# Altium project besc proj.PrjPcb
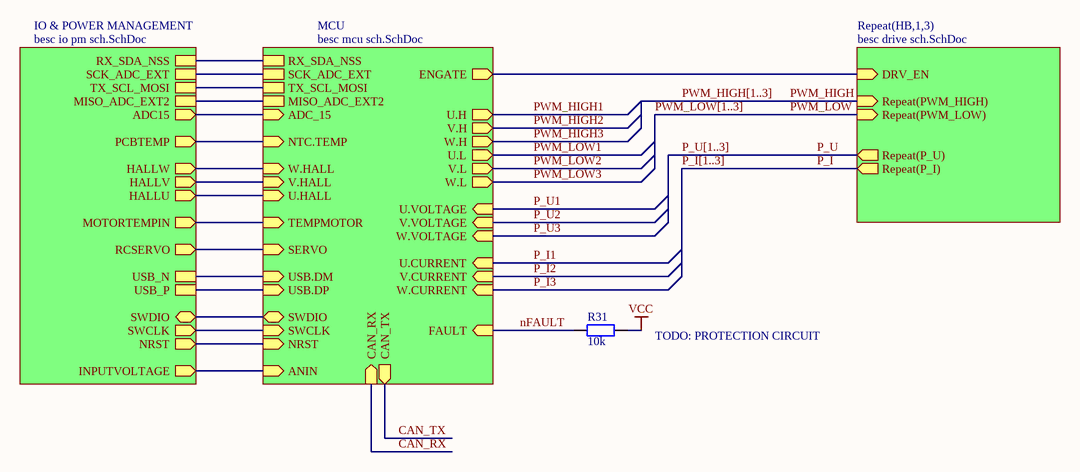
[diagram p0: besc sch.SchDoc]
4 sheets, 170 parts. Net scope: hierarchical (ports join the sheet entries above them; power ports are global).
Board file: besc pcb.PcbDoc
Sheets:
  besc sch.SchDoc
    MCU = besc mcu sch.SchDoc
    IO & POWER MANAGEMENT = besc io pm sch.SchDoc
    HB1 = besc drive sch.SchDoc
    HB2 = besc drive sch.SchDoc
    HB3 = besc drive sch.SchDoc

## Sheet besc sch.SchDoc
size A4

### Parts
R31  10k  [0603]

### Sub-sheets
IO & POWER MANAGEMENT = besc io pm sch.SchDoc: USB_P, USB_N, PCBTEMP (out), HALLW (out), HALLV (out), HALLU (out), RCSERVO (out), NRST (out), SWCLK (out), SWDIO (bidir), RX_SDA_NSS, SCK_ADC_EXT, TX_SCL_MOSI, MISO_ADC_EXT2, MOTORTEMPIN (out), INPUTVOLTAGE (out), ADC15 (out)
MCU = besc mcu sch.SchDoc: W.VOLTAGE (in), V.VOLTAGE (in), U.VOLTAGE (in), W.H (out), V.H (out), U.H (out), W.L (out), V.L (out), U.L (out), V.CURRENT (in), U.CURRENT (in), ENGATE (out), FAULT (in), NTC.TEMP (in), SCK_ADC_EXT, MISO_ADC_EXT2, W.HALL (in), V.HALL (in), U.HALL (in), USB.DM (in), USB.DP (in), SWCLK (in), SWDIO (bidir), SERVO (in), CAN_RX (in), CAN_TX (out), TEMPMOTOR (in), ANIN (in), NRST (in), W.CURRENT (in), RX_SDA_NSS, TX_SCL_MOSI, ADC_15 (in)
Repeat(HB,1,3) = besc drive sch.SchDoc: Repeat(P_U) (out), Repeat(PWM_HIGH) (in), Repeat(PWM_LOW) (in), Repeat(P_I) (out), DRV_EN (in)

### Nets
VCC: R31.2
ADC1: sheet MCU/MISO_ADC_EXT2, sheet IO & POWER MANAGEMENT/MISO_ADC_EXT2
ADC15: sheet MCU/ADC_15, sheet IO & POWER MANAGEMENT/ADC15
ENGATE: sheet MCU/ENGATE, sheet Repeat(HB,1,3)/DRV_EN
HALLU: sheet MCU/U.HALL, sheet IO & POWER MANAGEMENT/HALLU
HALLV: sheet MCU/V.HALL, sheet IO & POWER MANAGEMENT/HALLV
HALLW: sheet MCU/W.HALL, sheet IO & POWER MANAGEMENT/HALLW
INPUTVOLTAGE: sheet MCU/ANIN, sheet IO & POWER MANAGEMENT/INPUTVOLTAGE
MOTORTEMPIN: sheet MCU/TEMPMOTOR, sheet IO & POWER MANAGEMENT/MOTORTEMPIN
nFAULT: R31.1 ; sheet MCU/FAULT
NRST: sheet MCU/NRST, sheet IO & POWER MANAGEMENT/NRST
P_I: sheet Repeat(HB,1,3)/Repeat(P_I)
P_U: sheet Repeat(HB,1,3)/Repeat(P_U)
PCBTEMP: sheet MCU/NTC.TEMP, sheet IO & POWER MANAGEMENT/PCBTEMP
PWM_HIGH: sheet Repeat(HB,1,3)/Repeat(PWM_HIGH)
PWM_LOW: sheet Repeat(HB,1,3)/Repeat(PWM_LOW)
RCSERVO: sheet MCU/SERVO, sheet IO & POWER MANAGEMENT/RCSERVO
RX: sheet MCU/RX_SDA_NSS, sheet IO & POWER MANAGEMENT/RX_SDA_NSS
SCK: sheet MCU/SCK_ADC_EXT, sheet IO & POWER MANAGEMENT/SCK_ADC_EXT
SWDIO: sheet MCU/SWDIO, sheet IO & POWER MANAGEMENT/SWDIO
SWSCK: sheet MCU/SWCLK, sheet IO & POWER MANAGEMENT/SWCLK
TX: sheet MCU/TX_SCL_MOSI, sheet IO & POWER MANAGEMENT/TX_SCL_MOSI
USB_N: sheet MCU/USB.DM, sheet IO & POWER MANAGEMENT/USB_N
USB_P: sheet MCU/USB.DP, sheet IO & POWER MANAGEMENT/USB_P

### Buses and harness runs
bus P_I[1..3]
bus P_U[1..3]
bus PWM_HIGH[1..3]
bus PWM_LOW[1..3]

### Notes on the sheet
- (near R31) TODO: PROTECTION CIRCUIT

### Library data of the parts
R31 = Res2: Resistor; Published: 8-Jun-2000; LatestRevisionDate: 17-Jul-2002; LatestRevisionNote: Re-released for DXP Platform.; PackageReference: AXIAL-0.4; Publisher: Altium Limited; PackageDescription: Axial Device, Thru-Hole; 2 Leads; 0.4 in Pin Spacing

## Sheet besc mcu sch.SchDoc
size A4
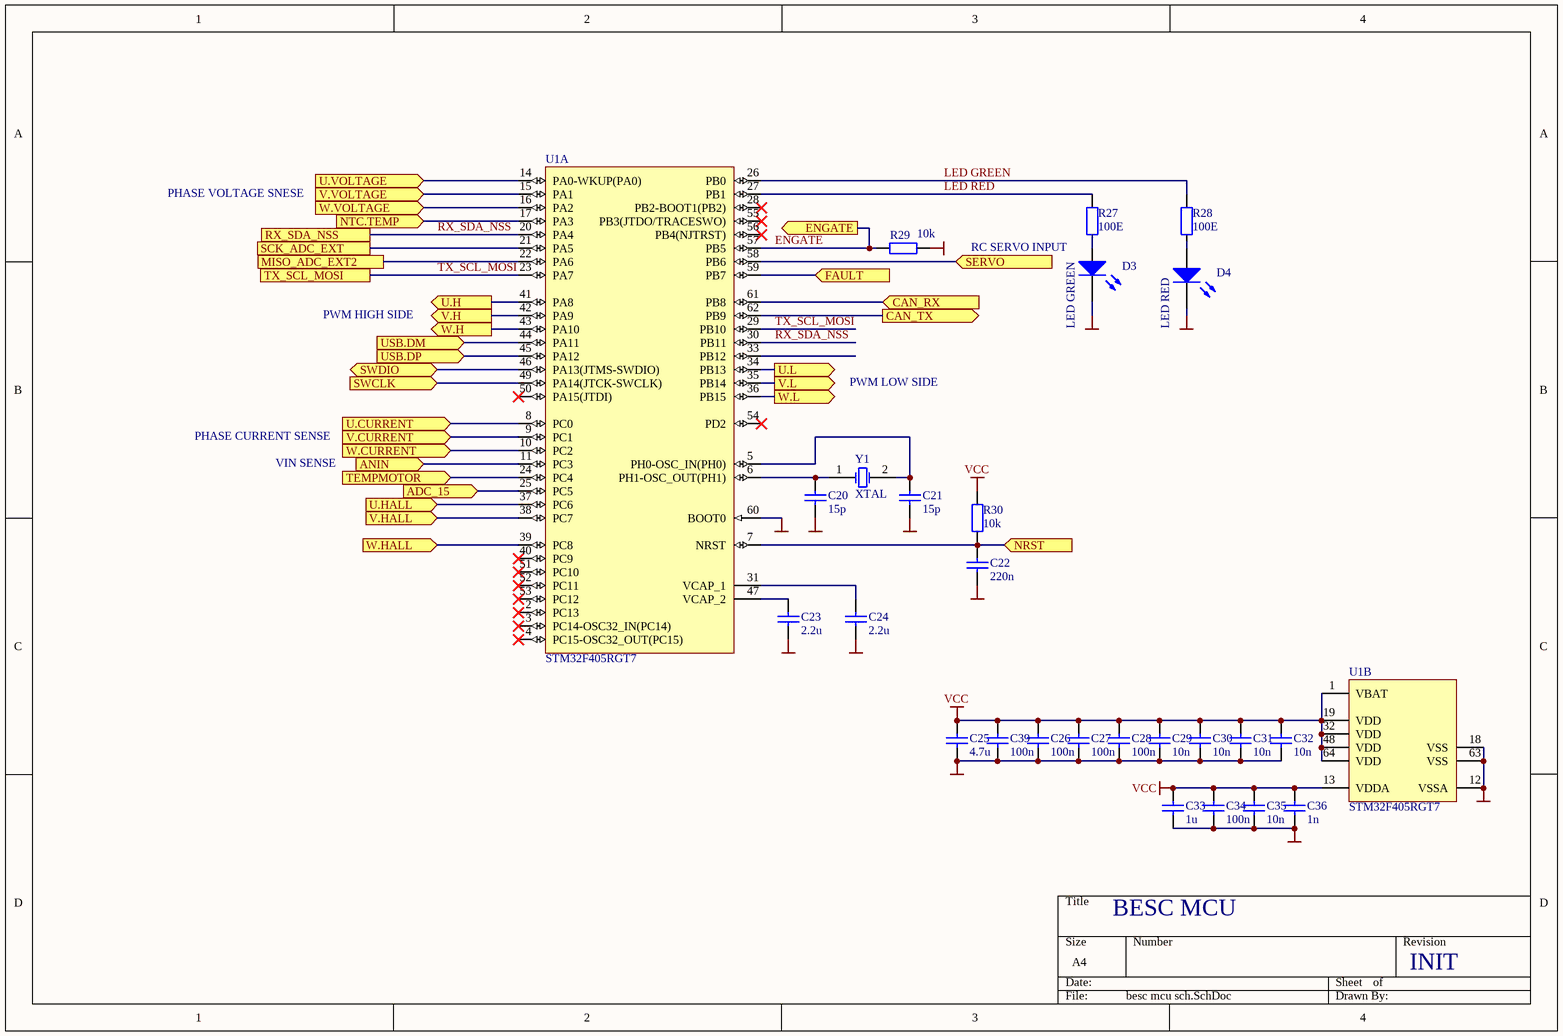
[diagram p1: besc mcu sch.SchDoc]

### Parts
C20  15p  [0603]
C21  15p  [0603]
C22  220n  [0603]
C23  2.2u  [0603]
C24  2.2u  [0603]
C25  4.7u  [0603]
C26  100n  [0603]
C27  100n  [0603]
C28  100n  [0603]
C29  10n  [0603]
C30  10n  [0603]
C31  10n  [0603]
C32  10n  [0603]
C33  1u  [0603]
C34  100n  [0603]
C35  10n  [0603]
C36  1n  [0603]
C39  100n  [0603]
D3  LED GREEN  [0805-diode]
D4  LED RED  [0805-diode]
R27  100E  [0603]
R28  100E  [0603]
R29  10k  [0603]
R30  10k  [0603]
U1  STM32F405RGT7  [STM-LQFP64_N]  (parts A,B of 2)
Y1  XTAL  [XTAL 5 x 3.2 mm]

### Ports
ADC_15 (in), ANIN (in), CAN_RX (in), CAN_TX (out), ENGATE (out), FAULT (in), MISO_ADC_EXT2, NRST (in), NTC.TEMP (in), RX_SDA_NSS, SCK_ADC_EXT, SERVO (in), SWCLK (in), SWDIO (bidir), TEMPMOTOR (in), TX_SCL_MOSI, U.CURRENT (in), U.H (out), U.HALL (in), U.L (out), U.VOLTAGE (in), USB.DM (in), USB.DP (in), V.CURRENT (in), V.H (out), V.HALL (in), V.L (out), V.VOLTAGE (in), W.CURRENT (in), W.H (out), W.HALL (in), W.L (out), W.VOLTAGE (in)

### Nets
LGND: C20.1 C21.1 C22.1 C23.1 C24.1 C25.1 C26.1 C27.1 C28.1 C29.1 C30.1 C31.1 C32.1 C33.1 C34.1 C35.1 C36.1 C39.1 D3.2(K) D4.2(K) R29.2 U1.12(VSSA) U1.18(VSS) U1.60(BOOT0) U1.63(VSS)
VCC: C25.2 C26.2 C27.2 C28.2 C29.2 C30.2 C31.2 C32.2 C33.2 C34.2 C35.2 C36.2 C39.2 R30.1 U1.1(VBAT) U1.13(VDDA) U1.19(VDD) U1.32(VDD) U1.48(VDD) U1.64(VDD)
ADC1: U1.22(PA6) ; port MISO_ADC_EXT2
ADC15: U1.25(PC5) ; port ADC_15
CAN_RX: U1.61(PB8) ; port CAN_RX
CAN_TX: U1.62(PB9) ; port CAN_TX
ENGATE: R29.1 U1.57(PB5) ; port ENGATE
HALLU: U1.37(PC6) ; port U.HALL
HALLV: U1.38(PC7) ; port V.HALL
HALLW: U1.39(PC8) ; port W.HALL
INPUTVOLTAGE: U1.11(PC3) ; port ANIN
LED GREEN: R28.1 U1.26(PB0)
LED RED: R27.1 U1.27(PB1)
MOTORTEMPIN: U1.24(PC4) ; port TEMPMOTOR
nFAULT: U1.59(PB7) ; port FAULT
NRST: C22.2 R30.2 U1.7(NRST) ; port NRST
P_I1: U1.8(PC0) ; port U.CURRENT
P_I2: U1.9(PC1) ; port V.CURRENT
P_I3: U1.10(PC2) ; port W.CURRENT
P_U1: U1.14(PA0-WKUP(PA0)) ; port U.VOLTAGE
P_U2: U1.15(PA1) ; port V.VOLTAGE
P_U3: U1.16(PA2) ; port W.VOLTAGE
PCBTEMP: U1.17(PA3) ; port NTC.TEMP
PWM_HIGH1: U1.41(PA8) ; port U.H
PWM_HIGH2: U1.42(PA9) ; port V.H
PWM_HIGH3: U1.43(PA10) ; port W.H
PWM_LOW1: U1.34(PB13) ; port U.L
PWM_LOW2: U1.35(PB14) ; port V.L
PWM_LOW3: U1.36(PB15) ; port W.L
RCSERVO: U1.58(PB6) ; port SERVO
RX_SDA_NSS: U1.20(PA4) U1.30(PB11) ; port RX_SDA_NSS  [project net RX]
SCK: U1.21(PA5) ; port SCK_ADC_EXT
SWDIO: U1.46(PA13(JTMS-SWDIO)) ; port SWDIO
SWSCK: U1.49(PA14(JTCK-SWCLK)) ; port SWCLK
TX_SCL_MOSI: U1.23(PA7) U1.29(PB10) ; port TX_SCL_MOSI  [project net TX]
USB_N: U1.44(PA11) ; port USB.DM
USB_P: U1.45(PA12) ; port USB.DP
NetC20_2: C20.2 U1.6(PH1-OSC_OUT(PH1)) Y1.1(OSC1)
NetC21_2: C21.2 U1.5(PH0-OSC_IN(PH0)) Y1.2(OSC2)
NetC23_2: C23.2 U1.47(VCAP_2)
NetC24_2: C24.2 U1.31(VCAP_1)
NetD3_1: D3.1(A) R27.2
NetD4_1: D4.1(A) R28.2

Not connected (* = marked no-connect by the designer): U1 2(PC13)* 3(PC14-OSC32_IN(PC14))* 4(PC15-OSC32_OUT(PC15))* 28(PB2-BOOT1(PB2))* 33(PB12) 40(PC9)* 50(PA15(JTDI))* 51(PC10)* 52(PC11)* 53(PC12)* 54(PD2)* 55(PB3(JTDO/TRACESWO))* 56(PB4(NJTRST))*

### Notes on the sheet
- PHASE VOLTAGE SNESE
- RC SERVO INPUT
- PWM HIGH SIDE
- PWM LOW SIDE
- PHASE CURRENT SENSE
- VIN SENSE
- BESC MCU
- INIT

### Library data of the parts
C20-C36 C39 = cap: Capacitor; Published: 8-Jun-2000; LatestRevisionDate: 17-Jul-2002; LatestRevisionNote: Re-released for DXP Platform.; PackageReference: RAD-0.3; Publisher: Altium Limited; PackageDescription: Radial Cap, Thru-Hole; 2 Leads; 0.3 in Pin Spacing
D3 D4 = LED0: Typical INFRARED GaAs LED; Published: 8-Jun-2000; LatestRevisionDate: 08-Jul-2005; LatestRevisionNote: Mech Layer 1 removed.; PackageReference: LED-0; Publisher: Altium Limited; PackageDescription: LED; 2 Leads
R27-R30 = Res2: Resistor; Published: 8-Jun-2000; LatestRevisionDate: 17-Jul-2002; LatestRevisionNote: Re-released for DXP Platform.; PackageReference: AXIAL-0.4; Publisher: Altium Limited; PackageDescription: Axial Device, Thru-Hole; 2 Leads; 0.4 in Pin Spacing
U1 = STM32F405RGT7: ARM Cortex-M4 32-bit MCU+FPU, 210 DMIPS, 1024 kB Flash, 192 kB Internal RAM, 51 I/Os, 64-pin LQFP, -40 to 105 degC, Tray; Manufacturer: STMicroelectronics; D/A Converter: 2x12-bit; FLASH Size (Prog) (kB): 1024; I/Os (High Current): 51; Internal RAM Size (kB): 192; Operating Frequency(F) (Processor speed) (MHz): 168; Supply Voltage(Vcc) max (V): 3.6; Supply Voltage(Vcc) min (V): 1.8; DatasheetVersion: Rev. 4; PackageVersion: Rev. 4, 06/2013; PackageReference: LQFP64; PackageDescription: 64-Pin Low Profile Quad Flat Package, 10 x 10 mm Body, 0.5 mm Pitch; Supplier 1: Farnell; Supplier Part Number 1: 2333285; Supplier 2: Newark; Supplier Part Number 2: 99W9902; Supplier 3: Mouser; Supplier Part Number 3: N/A; Core: ARM Cortex-M4; Packing: Tray; Mounting Technology: Surface Mount; PartNumber: STM32F405RGT7; ComponentLink1Description: Manufacturer URL; ComponentLink1URL: http://www.st.com/web/en/home.html; ComponentLink2Description: Datasheet; ComponentLink2URL: http://www.st.com/st-web-ui/static/active/en/resource/technical/document/datasheet/DM00037051.pdf; ComponentLink3Description: Package Specification; ComponentLink3URL: http://www.st.com/st-web-ui/static/active/en/resource/technical/document/datasheet/DM00037051.pdf
Y1 = XTAL: Crystal Oscillator; Published: 8-Jun-2000; LatestRevisionDate: 17-Jul-2002; LatestRevisionNote: Re-released for DXP Platform.; PackageReference: R38; Publisher: Altium Limited; PackageDescription: Crystal, Thru-Hole; 2 Leads; Body 3.1 x 8.2 mm (Dia.xH)

## Sheet besc io pm sch.SchDoc
size A4
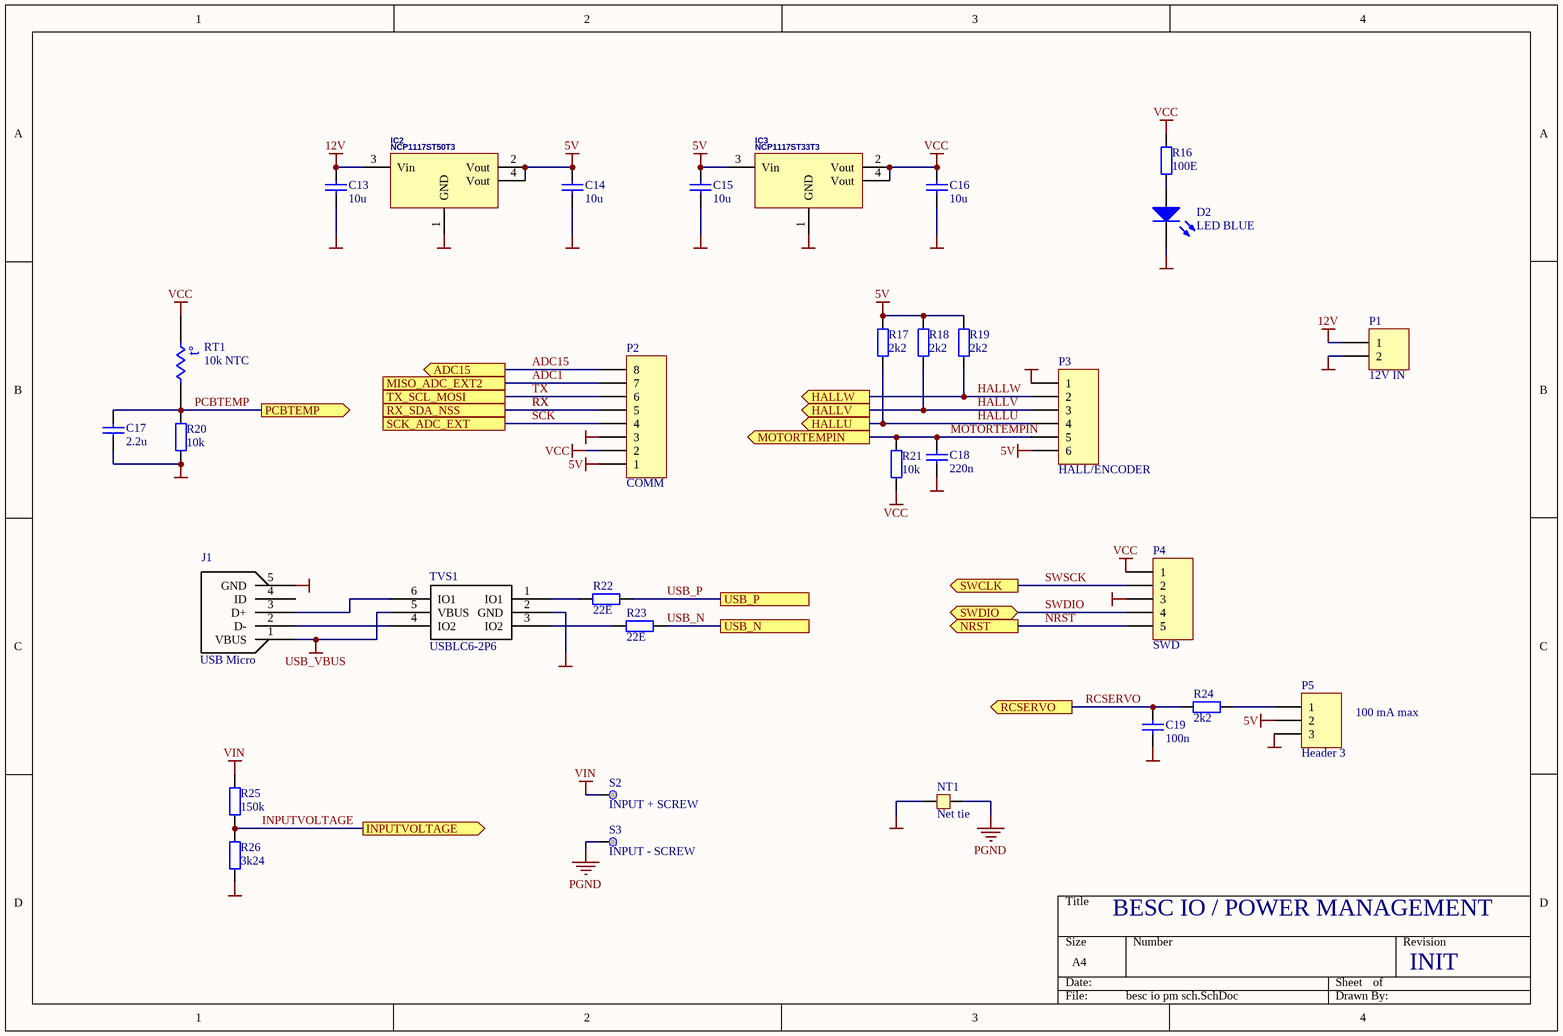
[diagram p2: besc io pm sch.SchDoc]

### Parts
C13  10u  [0805]
C14  10u  [0805]
C15  10u  [0805]
C16  10u  [0805]
C17  2.2u  [0603]
C18  220n  [0603]
C19  100n  [0603]
D2  LED BLUE  [0805-diode]
IC2  NCP1117ST50T3  [SOT223_M]
IC3  NCP1117ST33T3  [SOT223_M]
J1  USB Micro  [MOLEX - 47346-0001 - MICRO USB TYPE B, RECEPTACLE, BOTTOM]
NT1  Net tie  [NETTIE12mil]
P1  12V IN  [JST SM02B-PASS-TB]
P2  COMM  [JST SM08B-PASS-TB]
P3  HALL/ENCODER  [JST SM06B-PASS-TB]
P4  SWD  [Header 1x5 male]
P5  Header 3  [JST SM03B-PASS-TB]
R16  100E  [0603]
R17  2k2  [0603]
R18  2k2  [0603]
R19  2k2  [0603]
R20  10k  [0603]
R21  10k  [0603]
R22  22E  [0603]
R23  22E  [0603]
R24  2k2  [0603]
R25  150k  [0603]
R26  3k24  [0603]
RT1  10k NTC  [0603]
S2  INPUT + SCREW  [WP-SHFU-M6]
S3  INPUT - SCREW  [WP-SHFU-M6]
TVS1  USBLC6-2P6  [SOT23127P600-8N]

### Ports
ADC15 (out), HALLU (out), HALLV (out), HALLW (out), INPUTVOLTAGE (out), MISO_ADC_EXT2, MOTORTEMPIN (out), NRST (out), PCBTEMP (out), RCSERVO (out), RX_SDA_NSS, SCK_ADC_EXT, SWCLK (out), SWDIO (bidir), TX_SCL_MOSI, USB_N, USB_P

### Nets
5V: C14.1 C15.1 IC2.2(Vout) IC2.4(Vout) IC3.3(Vin) P2.1 P3.6 P5.2 R17.1 R18.1 R19.1
12V: C13.1 IC2.3(Vin) P1.1
LGND: C13.2 C14.2 C15.2 C16.2 C17.2 C18.2 C19.1 D2.2(K) IC2.1(GND) IC3.1(GND) J1.5(GND) NT1.1 P1.2 P2.3 P3.1 P4.3 P5.3 R20.2 R26.2 TVS1.2(GND)
PGND: NT1.2 S3.1
USB_VBUS: J1.1(VBUS) TVS1.5(VBUS)
VCC: C16.1 IC3.2(Vout) IC3.4(Vout) P2.2 P4.1 R16.1 R21.1 RT1.1
VIN: R25.1 S2.1
ADC1: P2.7 ; port MISO_ADC_EXT2
ADC15: P2.8 ; port ADC15
HALLU: P3.4 R17.2 ; port HALLU
HALLV: P3.3 R18.2 ; port HALLV
HALLW: P3.2 R19.2 ; port HALLW
INPUTVOLTAGE: R25.2 R26.1 ; port INPUTVOLTAGE
MOTORTEMPIN: C18.1 P3.5 R21.2 ; port MOTORTEMPIN
NRST: P4.5 ; port NRST
PCBTEMP: C17.1 R20.1 RT1.2 ; port PCBTEMP
RCSERVO: C19.2 R24.1 ; port RCSERVO
RX: P2.5 ; port RX_SDA_NSS
SCK: P2.4 ; port SCK_ADC_EXT
SWDIO: P4.4 ; port SWDIO
SWSCK: P4.2 ; port SWCLK
TX: P2.6 ; port TX_SCL_MOSI
USB_N: R23.1 ; port USB_N
USB_P: R22.1 ; port USB_P
NetD2_1: D2.1(A) R16.2
NetJ1_2: J1.2(D-) TVS1.4(IO2)
NetJ1_3: J1.3(D+) TVS1.6(IO1)
NetP5_1: P5.1 R24.2
NetR22_2: R22.2 TVS1.1(IO1)
NetR23_2: R23.2 TVS1.3(IO2)

Not connected (* = marked no-connect by the designer): J1 4(ID)

### Notes on the sheet
- 100 mA max
- BESC IO / POWER MANAGEMENT
- INIT
- (in symbol Res Thermal) t°

### Library data of the parts
C13-C19 = Cap: Capacitor; Published: 8-Jun-2000; LatestRevisionDate: 17-Jul-2002; LatestRevisionNote: Re-released for DXP Platform.; PackageReference: RAD-0.3; Publisher: Altium Limited; Supplier 1: Farnell; Supplier Part Number 1: 1833862
D2 = LED0: Typical INFRARED GaAs LED; Published: 8-Jun-2000; LatestRevisionDate: 08-Jul-2005; LatestRevisionNote: Mech Layer 1 removed.; PackageReference: LED-0; Publisher: Altium Limited; PackageDescription: LED; 2 Leads
IC2 IC3 = VOLTREG_LD1117S33: DETAILS: LOW DROP VOLTAGE REGULATOR 3V3; PRODUCER: ONSEMI: NCP1117ST33T3; SUPPLIER 4: SILICA
J1 = USB Mini AB: SOCKET, USB MINI-AB THRU HOLE; Manufacturer: MOLEX; Part number: 565790511; Farnel: http://uk.farnell.com/jsp/endecaSearch/partDetail.jsp?SKU=4768292&N=401
P1 = Header 2: JST SM02B-PASS-TB; LatestRevisionDate: 17-Jul-2002; LatestRevisionNote: Re-released for DXP Platform.; Publisher: Altium Limited
P2 = Header 8: JST SM08B-PASS-TB; LatestRevisionDate: 17-Jul-2002; LatestRevisionNote: Re-released for DXP Platform.; Publisher: Altium Limited
P3 = Header 6: JST SM06B-PASS-TB; LatestRevisionDate: 17-Jul-2002; LatestRevisionNote: Re-released for DXP Platform.; Publisher: Altium Limited
P4 = Header 5: Header, 5-Pin; LatestRevisionDate: 17-Jul-2002; LatestRevisionNote: Re-released for DXP Platform.; Publisher: Altium Limited
P5 = Header 3: Header, 3-Pin; LatestRevisionDate: 17-Jul-2002; LatestRevisionNote: Re-released for DXP Platform.; Publisher: Altium Limited
R16-R26 = Res2: Resistor; Published: 8-Jun-2000; LatestRevisionDate: 17-Jul-2002; LatestRevisionNote: Re-released for DXP Platform.; PackageReference: AXIAL-0.4; Publisher: Altium Limited; PackageDescription: Axial Device, Thru-Hole; 2 Leads; 0.4 in Pin Spacing
RT1 = Res Thermal: Thermistor; Published: 24-Mar-1999; LatestRevisionDate: 29-May-2009; LatestRevisionNote: IPC-7351 Footprint Added.; PackageVersion: Mar-2003; PackageReference: 6-0805; Publisher: Altium Limited; PackageDescription: Chip Resistor 0805 Case Size; Code_IPC: RESC2012
S2 S3 = En_pin: 7461098

## Sheet besc drive sch.SchDoc
size A4
Used 3 times, as channels HB1, HB2, HB3. Parts and nets are listed once, with the designators drawn on the sheet.
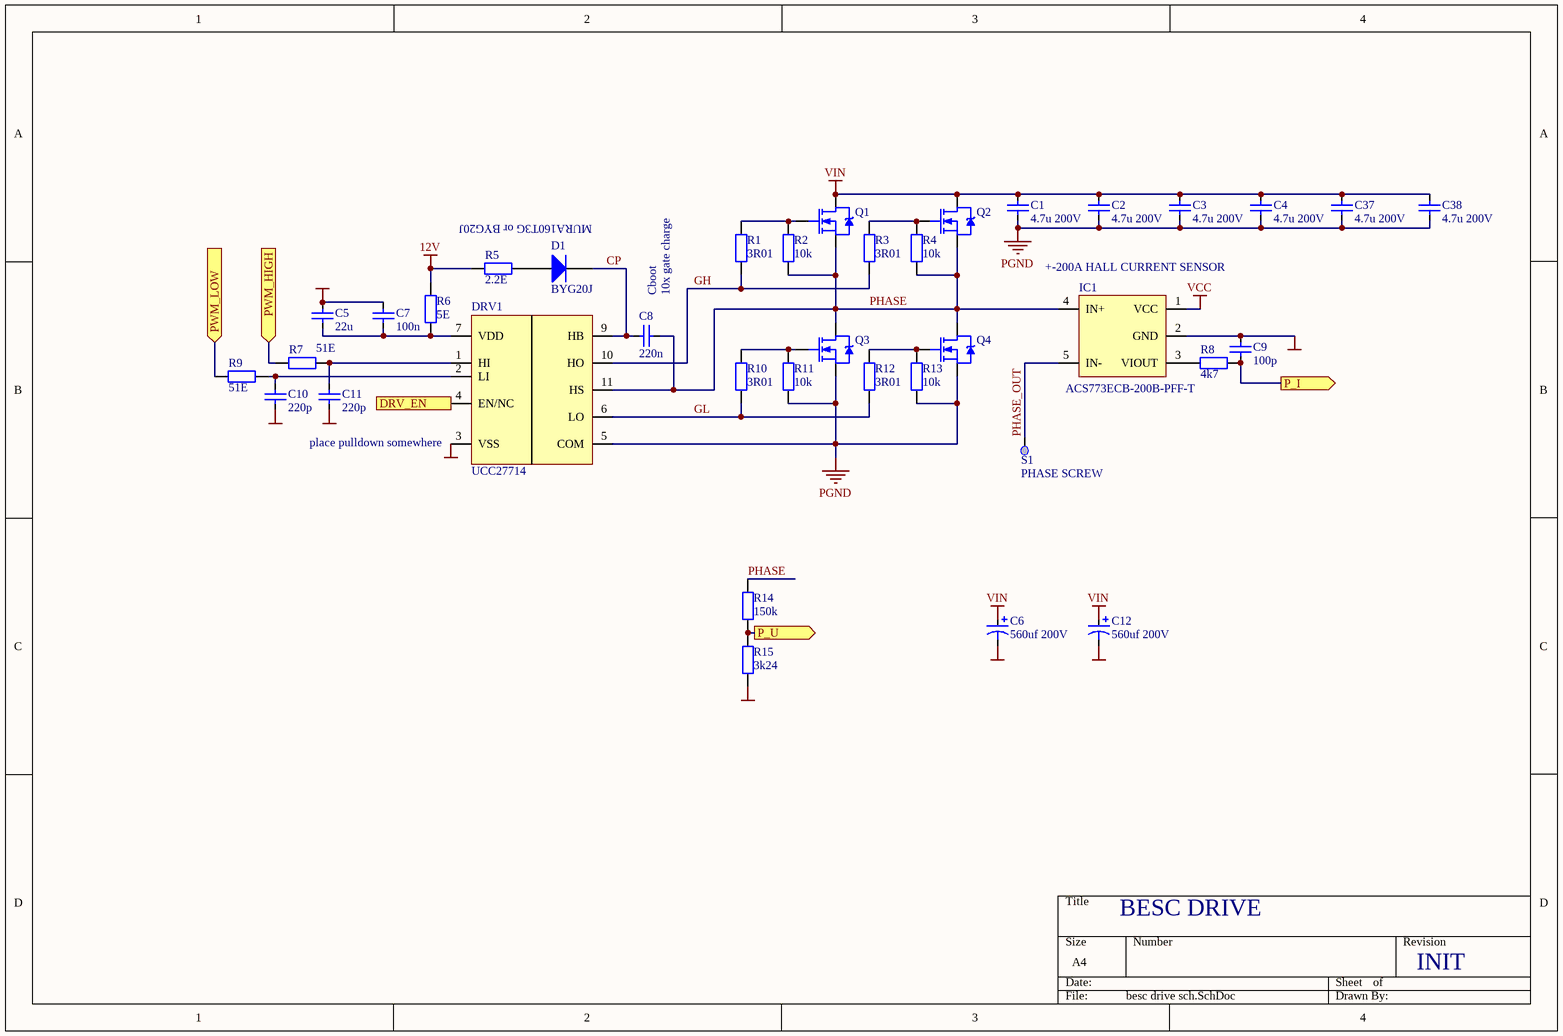
[diagram p3: besc drive sch.SchDoc]

### Parts
C1  4.7u 200V  [CAP 2220/5650 3.3MM]
C2  4.7u 200V  [CAP 2220/5650 3.3MM]
C3  4.7u 200V  [CAP 2220/5650 3.3MM]
C4  4.7u 200V  [CAP 2220/5650 3.3MM]
C5  22u  [0805]
C6  560uf 200V  [ELKO_18x40_90deg]
C7  100n  [0603]
C8  220n  [0603]
C9  100p  [0603]
C10  220p  [0402]
C11  220p  [0402]
C12  560uf 200V  [ELKO_18x40_90deg]
C37  4.7u 200V  [CAP 2220/5650 3.3MM]
C38  4.7u 200V  [CAP 2220/5650 3.3MM]
D1  BYG20J  [DO-214AC]
DRV1  UCC27714  [SOIC14_M]
IC1  ACS773ECB-200B-PFF-T  [ACS758]
Q1  IPB044N15N5  [Dpak-7]  (value not drawn)
Q2  IPB044N15N5  [Dpak-7]  (value not drawn)
Q3  IPB044N15N5  [Dpak-7]  (value not drawn)
Q4  IPB044N15N5  [Dpak-7]  (value not drawn)
R1  3R01  [0603]
R2  10k  [0603]
R3  3R01  [0603]
R4  10k  [0603]
R5  2.2E  [1210]
R6  5E  [0603]
R7  51E  [0402]
R8  4k7  [0603]
R9  51E  [0402]
R10  3R01  [0603]
R11  10k  [0603]
R12  3R01  [0603]
R13  10k  [0603]
R14  150k  [0805]
R15  3k24  [0402]
S1  PHASE SCREW  [WP-SHFU-M6]

### Ports
DRV_EN (in), P_I (out), P_U (out), PWM_HIGH (in), PWM_LOW (in)

### Nets
12V: R5.2 R6.1
LGND: C5.2 C7.2 C9.2 C10.2 C11.2 DRV1.3(VSS) IC1.2(GND) R15.2
PGND: C1.1 C2.1 C3.1 C4.1 C6.2 C12.2 C37.1 C38.1 DRV1.5(COM) Q3.2(S) Q4.2(S) R11.2 R13.2
VCC: IC1.1(VCC)
VIN: C1.2 C2.2 C3.2 C4.2 C6.1 C12.1 C37.2 C38.2 Q1.3(D) Q2.3(D)
CP: C8.2 D1.2(K) DRV1.9(HB)
DRV_EN: DRV1.4(EN/NC) ; port DRV_EN
GH: DRV1.10(HO) R1.2 R3.2
GL: DRV1.6(LO) R10.2 R12.2
P_I: C9.1 R8.1 ; port P_I
P_U: R14.2 R15.1 ; port P_U
PHASE: C8.1 DRV1.11(HS) IC1.4(IN+) Q1.2(S) Q2.2(S) Q3.3(D) Q4.3(D) R2.2 R4.2 R14.1
PHASE_OUT: IC1.5(IN-) S1.1
PWM_HIGH: R7.2 ; port PWM_HIGH
PWM_LOW: R9.1 ; port PWM_LOW
NetC5_1: C5.1 C7.1 DRV1.7(VDD) R6.2
NetC10_1: C10.1 DRV1.2(LI) R9.2
NetC11_1: C11.1 DRV1.1(HI) R7.1
NetD1_1: D1.1(A) R5.1
NetIC1_3: IC1.3(VIOUT) R8.2
NetQ1_1: Q1.1(G) R1.1 R2.1
NetQ2_1: Q2.1(G) R3.1 R4.1
NetQ3_1: Q3.1(G) R10.1 R11.1
NetQ4_1: Q4.1(G) R12.1 R13.1

Not connected (* = marked no-connect by the designer): DRV1 8(NC) 12(NC) 13(NC) 14(NC)

### Channels
HB1: designators end in _HB1; ports DRV_EN=ENGATE P_I=P_I1 P_U=P_U1 PWM_HIGH=PWM_HIGH1 PWM_LOW=PWM_LOW1
HB2: designators end in _HB2; ports DRV_EN=ENGATE P_I=P_I2 P_U=P_U2 PWM_HIGH=PWM_HIGH2 PWM_LOW=PWM_LOW2
HB3: designators end in _HB3; ports DRV_EN=ENGATE P_I=P_I3 P_U=P_U3 PWM_HIGH=PWM_HIGH3 PWM_LOW=PWM_LOW3

### Notes on the sheet
- MURA160T3G or BYG20J
- (near C8) Cboot
- (near C8) 10x gate charge
- +-200A HALL CURRENT SENSOR
- (near DRV1) place pulldown somewhere
- BESC DRIVE
- INIT

### Library data of the parts
C1-C5 C7-C11 C37 C38 = cap: Capacitor; Published: 8-Jun-2000; LatestRevisionDate: 17-Jul-2002; LatestRevisionNote: Re-released for DXP Platform.; PackageReference: RAD-0.3; Publisher: Altium Limited; PackageDescription: Radial Cap, Thru-Hole; 2 Leads; 0.3 in Pin Spacing
  C1: url: https://www.aliexpress.com/item/5pcs-SMD-capacitor-5750-2220-4-7UF-200V-250V-475K-X7R-10-Non-polarity/32633946304.html?spm=2114.search0104.3.15.470c328aPXtbgJ&ws_ab_test=searchweb0_0,searchweb201602_1_10065_10068_318_319_5731311_317_10696_5728811_10084_10083_10618_452_10304_10307_5731411_10820_532_10301_10821_5731211_5731111_204_328_10059_10884_323_10887_5731511_100031_5731611_320_321_322_5731711_10103,searchweb201603_55,ppcSwitch_0&algo_expid=2440df57-4916-4206-b13e-2c99e03a8745-2&algo_pvid=2440df57-4916-4206-b13e-2c99e03a8745
C6 C12 = Cap Pol1: Polarized Capacitor (Radial); Published: 8-Jun-2000; LatestRevisionDate: 17-Jul-2002; LatestRevisionNote: Re-released for DXP Platform.; PackageReference: RB7.6-15; Publisher: Altium Limited; PackageDescription: Polarized Capacitor (Radial); 2 Leads
D1 = Diode 1N4148: High Conductance Fast Diode; Published: 8-Jun-2000; LatestRevisionDate: 17-Jul-2002; LatestRevisionNote: Re-released for DXP Platform.; DatasheetVersion: 1997; PackageReference: DO-35; Publisher: Altium Limited; PackageDescription: Diode, Axial; Body 3.8 x 1.9 mm (LxDia. max), Lead Dia. 0.53 mm (max); Code_JEDEC: DO-204-AH; ComponentLink1Description: Manufacturer Link; ComponentLink1URL: http://www.fairchildsemi.com/; ComponentLink2Description: Datasheet; ComponentLink2URL: http://www.fairchildsemi.com/ds/1N%2F1N4148.pdf
IC1 = ACS758
Q1-Q4 = NMOS-2: N-Channel Power MOSFET; Note: Pin 2 is electrically connected to pin 4.; Published: 8-Jun-2000; LatestRevisionDate: 17-Jul-2002; LatestRevisionNote: Re-released for DXP Platform.; DatasheetVersion: PD-9.814; PackageVersion: Feb-1997; PackageReference: TO-220AB; Publisher: Altium Limited; PackageDescription: TO, Thru-Hole, Vertical, Heatsink Mounted; 3 In-Line Leads; Pitch 2.54 mm; ComponentLink1Description: Manufacturer Link; ComponentLink1URL: http://www.irf.com/
R1-R13 R15 = Res2: Resistor; Published: 8-Jun-2000; LatestRevisionDate: 17-Jul-2002; LatestRevisionNote: Re-released for DXP Platform.; PackageReference: AXIAL-0.4; Publisher: Altium Limited; PackageDescription: Axial Device, Thru-Hole; 2 Leads; 0.4 in Pin Spacing
R14 = Res2: 250 mW 0805; Published: 8-Jun-2000; LatestRevisionDate: 17-Jul-2002; LatestRevisionNote: Re-released for DXP Platform.; PackageReference: AXIAL-0.4; Publisher: Altium Limited; PackageDescription: Axial Device, Thru-Hole; 2 Leads; 0.4 in Pin Spacing
S1 = En_pin: 7461098

## Nets that join several sheets
12V: besc io pm sch (C13.1 IC2.3 P1.1), HB1 (R5_HB1.2 R6_HB1.1), HB2 (R5_HB2.2 R6_HB2.1), HB3 (R5_HB3.2 R6_HB3.1)
LGND: besc mcu sch (25 pins), besc io pm sch (20 pins), HB1 (8 pins), HB2 (8 pins), HB3 (8 pins)
PGND: besc io pm sch (NT1.2 S3.1), HB1 (13 pins), HB2 (13 pins), HB3 (13 pins)
VCC: besc sch (R31.2), besc mcu sch (20 pins), besc io pm sch (8 pins), HB1 (IC1_HB1.1), HB2 (IC1_HB2.1), HB3 (IC1_HB3.1)
VIN: besc io pm sch (R25.1 S2.1), HB1 (10 pins), HB2 (10 pins), HB3 (10 pins)
ADC1: besc mcu sch (U1.22), besc io pm sch (P2.7)
ADC15: besc mcu sch (U1.25), besc io pm sch (P2.8)
ENGATE: besc mcu sch (R29.1 U1.57), HB1 (DRV1_HB1.4), HB2 (DRV1_HB2.4), HB3 (DRV1_HB3.4)
HALLU: besc mcu sch (U1.37), besc io pm sch (P3.4 R17.2)
HALLV: besc mcu sch (U1.38), besc io pm sch (P3.3 R18.2)
HALLW: besc mcu sch (U1.39), besc io pm sch (P3.2 R19.2)
INPUTVOLTAGE: besc mcu sch (U1.11), besc io pm sch (R25.2 R26.1)
MOTORTEMPIN: besc mcu sch (U1.24), besc io pm sch (C18.1 P3.5 R21.2)
nFAULT: besc sch (R31.1), besc mcu sch (U1.59)
NRST: besc mcu sch (C22.2 R30.2 U1.7), besc io pm sch (P4.5)
P_I1: besc mcu sch (U1.8), HB1 (C9_HB1.1 R8_HB1.1)
P_I2: besc mcu sch (U1.9), HB2 (C9_HB2.1 R8_HB2.1)
P_I3: besc mcu sch (U1.10), HB3 (C9_HB3.1 R8_HB3.1)
P_U1: besc mcu sch (U1.14), HB1 (R14_HB1.2 R15_HB1.1)
P_U2: besc mcu sch (U1.15), HB2 (R14_HB2.2 R15_HB2.1)
P_U3: besc mcu sch (U1.16), HB3 (R14_HB3.2 R15_HB3.1)
PCBTEMP: besc mcu sch (U1.17), besc io pm sch (C17.1 R20.1 RT1.2)
PWM_HIGH1: besc mcu sch (U1.41), HB1 (R7_HB1.2)
PWM_HIGH2: besc mcu sch (U1.42), HB2 (R7_HB2.2)
PWM_HIGH3: besc mcu sch (U1.43), HB3 (R7_HB3.2)
PWM_LOW1: besc mcu sch (U1.34), HB1 (R9_HB1.1)
PWM_LOW2: besc mcu sch (U1.35), HB2 (R9_HB2.1)
PWM_LOW3: besc mcu sch (U1.36), HB3 (R9_HB3.1)
RCSERVO: besc mcu sch (U1.58), besc io pm sch (C19.2 R24.1)
RX: besc mcu sch (U1.20 U1.30), besc io pm sch (P2.5)
SCK: besc mcu sch (U1.21), besc io pm sch (P2.4)
SWDIO: besc mcu sch (U1.46), besc io pm sch (P4.4)
SWSCK: besc mcu sch (U1.49), besc io pm sch (P4.2)
TX: besc mcu sch (U1.23 U1.29), besc io pm sch (P2.6)
USB_N: besc mcu sch (U1.44), besc io pm sch (R23.1)
USB_P: besc mcu sch (U1.45), besc io pm sch (R22.1)